# Altium schematic sheet e_stop_pcb_schematic_2_22_2026.SchDoc
size A; SheetNumber: 1; SheetTotal: 2
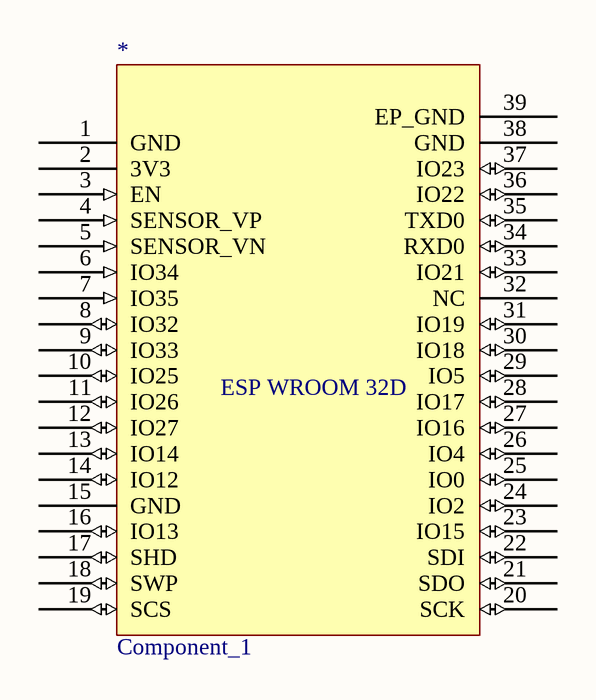
[diagram p0: e_stop_pcb_schematic_2_22_2026.SchDoc]

## Parts
*  Component_1  [ESP32-WROOM-32D]

## Nets

Not connected (* = marked no-connect by the designer): * 1(GND) 2(3V3) 3(EN) 4(SENSOR_VP) 5(SENSOR_VN) 6(IO34) 7(IO35) 8(IO32) 9(IO33) 10(IO25) 11(IO26) 12(IO27) 13(IO14) 14(IO12) 15(GND) 16(IO13) 17(SHD) 18(SWP) 19(SCS) 20(SCK) 21(SDO) 22(SDI) 23(IO15) 24(IO2) 25(IO0) 26(IO4) 27(IO16) 28(IO17) 29(IO5) 30(IO18) 31(IO19) 32(NC) 33(IO21) 34(RXD0) 35(TXD0) 36(IO22) 37(IO23) 38(GND) 39(EP_GND)

## Notes on the sheet
- (in symbol Component_1) ESP WROOM 32D